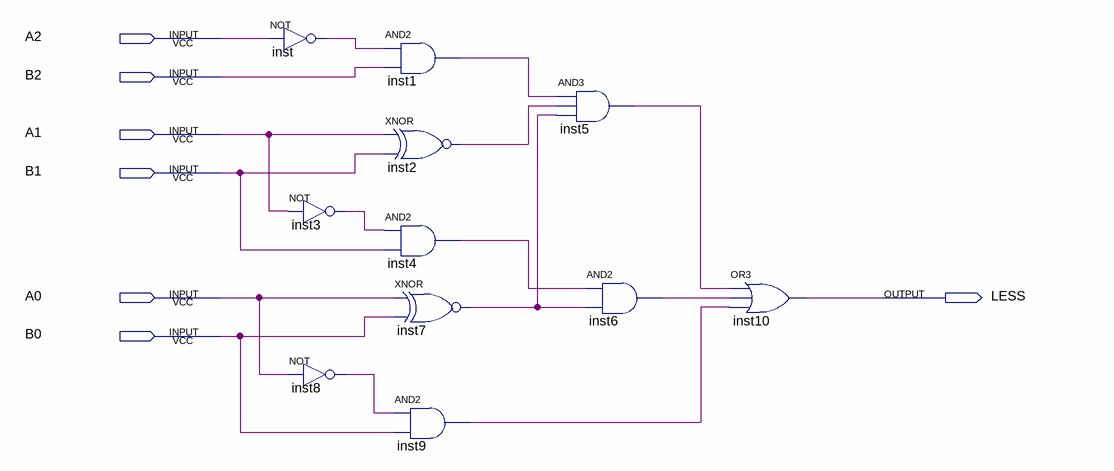
[diagram p0: schematic sheet]
// Quartus schematic LAB_2_1.bdf as structural Verilog: 11 symbols, 7 pins
module LAB_2_1 (
  input  A2,
  input  B2,
  input  A1,
  input  B1,
  input  A0,
  input  B0,
  output LESS
);

  wire inst1_out, inst2_out, inst3_out, inst4_out, inst5_out, inst6_out, inst7_out, inst8_out, inst9_out,
       inst_out;

  not inst (inst_out, A2);
  not inst3 (inst3_out, A1);
  not inst8 (inst8_out, A0);
  and inst1 (inst1_out, inst_out, B2);
  xnor inst2 (inst2_out, A1, B1);
  and inst4 (inst4_out, inst3_out, B1);
  xnor inst7 (inst7_out, A0, B0);
  and inst9 (inst9_out, inst8_out, B0);
  and inst5 (inst5_out, inst1_out, inst2_out, inst7_out);
  and inst6 (inst6_out, inst4_out, inst7_out);
  or inst10 (LESS, inst5_out, inst6_out, inst9_out);
endmodule
